# Altium schematic sheet FuenteAlimentacion.SchDoc
size A4
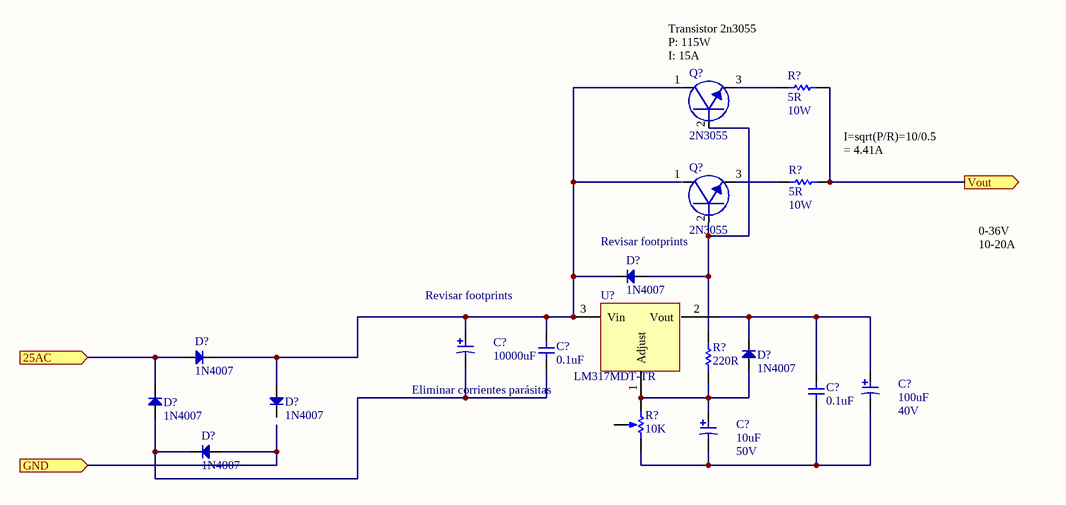
[diagram p0: FuenteAlimentacion.SchDoc]

## Parts
(Parts that share a designator on the sheet are numbered #1, #2 ... from top to bottom, then left to right.)
C?#1  value 10000uF  [C Elec TH V 18x35-7.5]  (hidden comment: C-Pol-10000uF-)
C?#2  value 0.1uF  [C0805-0.80]  (hidden comment: C-Cer-0.1uF-0603-50V)
C?#3  value 100uF  VDC: 40V  [RAD-0.3]  (hidden comment: C-Ele-100uF-08-40V)
C?#4  value 0.1uF  [C0805-0.80]  (hidden comment: C-Cer-0.1uF-0603-50V)
C?#5  value 10uF  Voltage: 50V  [C Elec TH V 18x35-7.5]  (hidden comment: C-Ele-10uF-05-50V)
D?#1  1N4007  [DO-35 Glass]
D?#2  1N4007  [DO-35 Glass]
D?#3  1N4007  [DO-35 Glass]
D?#4  1N4007  [DO-35 Glass]
D?#5  1N4007  [DO-35 Glass]
D?#6  1N4007  [DO-35 Glass]
Q?#1  2N3055  [TO92-2.54]
Q?#2  2N3055  [TO92-2.54]
R?#1  value 5R  Power: 10W  [R Axial 0.4]  (hidden comment: R-5-08-5)
R?#2  value 5R  Power: 10W  [R Axial 0.4]  (hidden comment: R-5-08-5)
R?#3  value 220R  [R0603-0.45]  (hidden comment: R-220-0603-5)
R?#4  value 10K  [VR5]  (hidden comment: RPot-10K-06-KNP)
U?  LM317MDT-TR  [TO220-3]

## Ports
25AC (in), GND (in), Vout (out)

## Nets
25AC: D?#2.2 D?#5.1 ; port 25AC
GND: D?#6.2 ; port GND
Vout: R?#1.2 R?#2.2 ; port Vout
NetC?#1_2: C?#1.2 C?#2.2 D?#1.1 D?#2.1 D?#4.2 Q?#1.1 U?.3(Vin)
NetC?#3_1: C?#3.1 C?#4.1 C?#5.1 R?#4.2(BOT)
NetC?#3_2: C?#3.2 C?#4.2 D?#3.1 U?.2(Vout)
NetC?#5_2: C?#5.2 D?#3.2 R?#3.1 R?#4.1(TOP) U?.1(Adjust)
NetD?#1_2: D?#1.2 Q?#1.2 R?#3.2
NetD?#5_2: D?#5.2 D?#6.1
NetQ?#1_3: Q?#1.3 R?#1.1
NetQ?#2_3: Q?#2.3 R?#2.1

Not connected (* = marked no-connect by the designer): C?#1 1; C?#2 1; D?#4 1; Q?#2 1 2; R?#4 3(TAP)

## Notes on the sheet
- Transistor 2n3055
  P: 115W
  I: 15A
- (near R?#2) I=sqrt(P/R)=10/0.5
  = 4.41A
- Revisar footprints
- 0-36V
  10-20A
- (near C?#1) Revisar footprints
- Eliminar corrientes parásitas

## Library data of the parts
C?#1 = C-Pol-10000uF-: Capacitor, polarized, generic; Manofacturer: Mouser; Manofacturer Supply Numb: B41252A6109M000
C?#2 C?#4 = C-Cer-0.1uF-0603-50V: Capacitor, generic; Manofacturer: Wurth Electronics; Manofacture Code: 885012206095; Supplier: Mouser; Supplier Number Code: 710-885012206095; Price: 0.05
C?#3 = C-Ele-100uF-08-40V: Capacitor; Manofacturer: Vishay / BC Components; Manofacturer Code: MAL203137101E3; Supplier: Mouser; Supplier Number Code: 594-2222-031-37101; Category: Capacitance-Electrolitic; Pricing: 0.638
C?#5 = C-Ele-10uF-05-50V: Capacitor, polarized, generic; Manofacturer: Lelon; Manofacturer Supply Numb: REA100M1HBK-0511P; Supplier: Mouser; Supplier Number Code: 140-REA100M1HBK0511P; Category: Capacitance-Electrolitic; Pricing: 0.086
D?#1 D?#3 = D-1N4007-G: Diodes - General Purpose, Power, Switching Hi Conductance Fast; Manofacturer: Comchip Technology; Manufacturer Code: 1N4007-G; Category: Diodes - General Purpose, Power, Switching; Pricing: 0.094; Supplier: Mouser; Supplier Number Code: 750-1N4007-G; Value: *
D?#2 D?#4-D?#6 = D-UF4004-TP-DO-41: Diodes - General Purpose, Power, Switching Hi Conductance Fast; Manofacturer: Micro Commercial Components (MCC); Manufacturer Code: UF4004-TP; Category: Diodes - General Purpose, Power, Switching; Pricing: 0.094; Supplier: Mouser; Supplier Number Code: 833-UF4004-TP; Value: *
Q?#1 Q?#2 = 2N3055: BJT NPN Transistor-2N3055G; Manofacturer: ON Semiconductor; Value: *; Supplier: Mouser; Supplier Number Code: 863-2N3055G; Manofacturer Code: 2N3055G; Pricing: 1.90; Category: Transistor-BJT-NPN
R?#1 R?#2 = R-5-08-5: Resistor, generic; Manofacturer: Xilon; Manofacturer Code: 280-CR10-5.0-RC; Category: Resistance; Supplier: Mouser; Supplier Number Code: 280-CR10-5.0-RC; Pricing: 0.799
R?#3 = R-220-0603-5: Resistor, generic; Manofacturer: Yageo; Manofacturer Code: RC0603JR-07220RL; Category: Resistance; Supplier: Mouser; Supplier Number Code: 603-RC0603JR-07220RL; Pricing: 0.085
R?#4 = RPot-10K-06-KNP: Potentiometer; Value: 10K; Manofacture: Welwyn Components / TT Electronics; Manofacture Code: P160KNPD-4FC20B10K; Supplier: Mouser; Category: Potentiometer; Supplier Number Code: 858-P160KNP4FC20B10K
U? = LM317MDT-TR: IC POS ADJ VOLTAGE REGUL. 1.2-37V; Manufacturer: STMicroelectronics; Category: Integrated Circuits (ICs); Supplier: Mouser; Supplier Number Code: 511-LM317MDT-TR; Pricing: 0.408; Manufacturer Part Number: LM317MDT-TR